# Altium schematic sheet SATA.SchDoc
size A4; DocumentNumber: 15; SheetNumber: 17; SheetTotal: 19
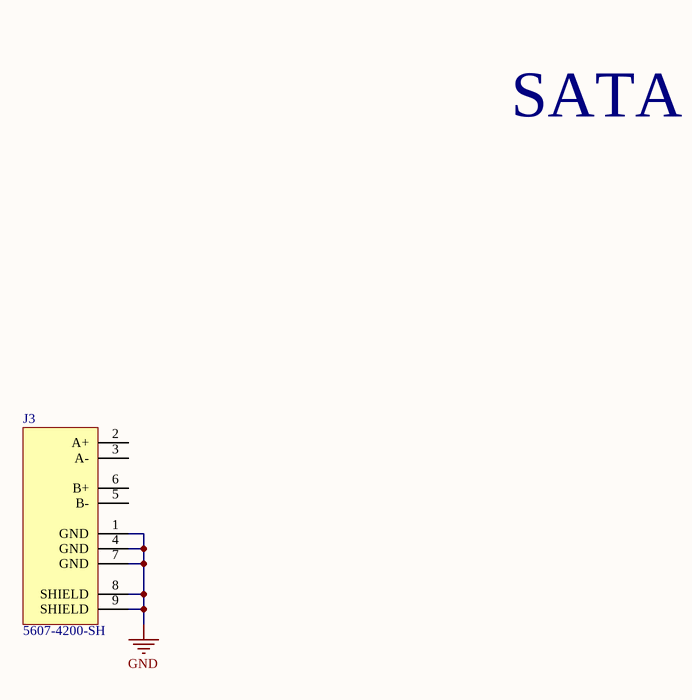
[diagram p0: SATA.SchDoc]

## Parts
J3  5607-4200-SH  [5607-4200-SH]

## Nets
GND: J3.1(GND) J3.4(GND) J3.7(GND) J3.8(SHIELD) J3.9(SHIELD)

Not connected (* = marked no-connect by the designer): J3 2(A+) 3(A-) 5(B-) 6(B+)

## Notes on the sheet
- SATA

## Library data of the parts
J3 = CONN_5607-4200-SH: 7 Position SATA Plug Connector Solder Surface Mount, Right Angle; Mfr: 3M; Supplier 1: Digi-Key; Supplier Part Number 1: 3M5561-ND; Connector Type: SATA; Mounting Type: Right Angle; ComponentLink1Description: Octoparts; ComponentLink1URL: https://octopart.com/5607-4200-sh-3m-656899; Created By: Pascal-Emmanuel Lachance; ComponentLink2Description: Digikey; ComponentLink2URL: https://www.digikey.ca/en/products/detail/3m/5607-4200-SH/1207102; ComponentLink3Description: Mouser; ComponentLink3URL: https://www.mouser.ca/ProductDetail/3M-Electronic-Solutions-Division/5607-4200-SH; ComponentLink4Description: Newark; ComponentLink4URL: https://canada.newark.com/3m/5607-4200-sh/sata-connector-plug-7-position/dp/18M6678; ComponentLink5Description: Datasheet; ComponentLink5URL: https://multimedia.3m.com/mws/media/412906O/3mtm-serial-adv-tech-attachment-sata-connector-cd2108.pdf